# Altium schematic sheet MCU.SchDoc
size A; SheetNumber: 2; SheetTotal: 3
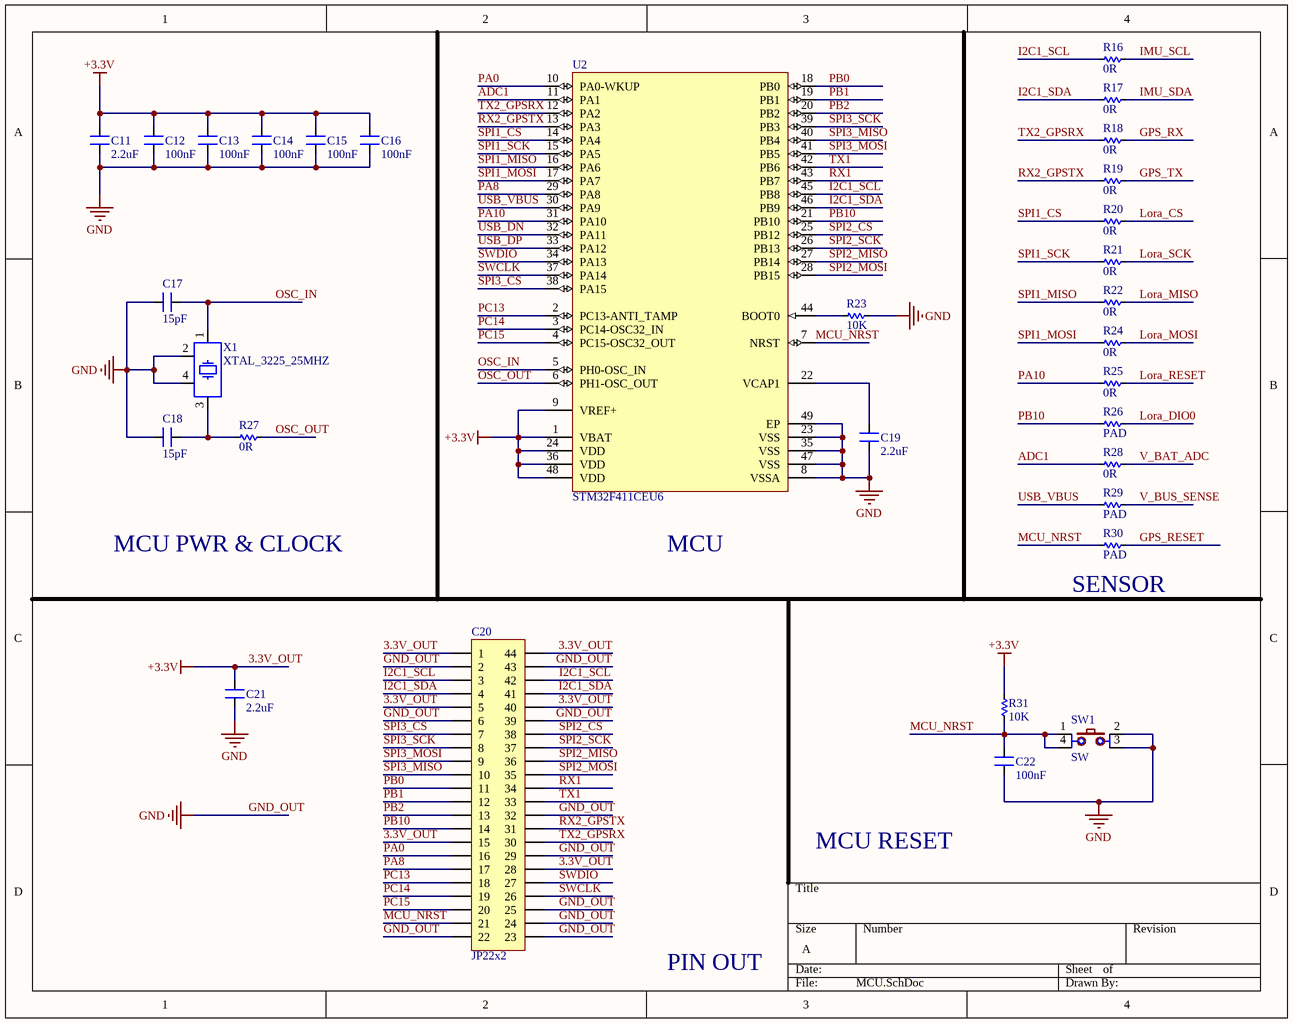
[diagram p0: MCU.SchDoc]

## Parts
C11  2.2uF  [CN-SMD-0805]
C12  100nF  [CN-SMD-0603]
C13  100nF  [CN-SMD-0603]
C14  100nF  [CN-SMD-0603]
C15  100nF  [CN-SMD-0603]
C16  100nF  [CN-SMD-0603]
C17  15pF  [CN-SMD-0603]
C18  15pF  [CN-SMD-0603]
C19  2.2uF  [CN-SMD-0805]
C20  JP22x2  [JP22-D2T]
C21  2.2uF  [CN-SMD-0805]
C22  100nF  [CN-SMD-0603]
R16  0R  [RES-SMD-0603]
R17  0R  [RES-SMD-0603]
R18  0R  [RES-SMD-0603]
R19  0R  [RES-SMD-0603]
R20  0R  [RES-SMD-0603]
R21  0R  [RES-SMD-0603]
R22  0R  [RES-SMD-0603]
R23  10K  [RES-SMD-0603]
R24  0R  [RES-SMD-0603]
R25  0R  [RES-SMD-0603]
R26  PAD  [PAD-RES-SMD-0603]
R27  0R  [RES-SMD-0603]
R28  0R  [RES-SMD-0603]
R29  PAD  [PAD-RES-SMD-0603]
R30  PAD  [PAD-RES-SMD-0603]
R31  10K  [RES-SMD-0603]
SW1  SW  [SW2-SMD]
U2  STM32F411CEU6  [STM-UFQFPN48_L]
X1  XTAL_3225_25MHZ  [XTAL_3225]

## Nets
3.3V_OUT: C11.2 C12.2 C13.2 C14.2 C15.2 C16.2 C20.1 C20.5 C20.15 C20.28 C20.40 C20.44 C21.2 R31.1 U2.1(VBAT) U2.9(VREF+) U2.24(VDD) U2.36(VDD) U2.48(VDD)  [also labelled +3.3V]
GND_OUT: C11.1 C12.1 C13.1 C14.1 C15.1 C16.1 C17.2 C18.2 C19.1 C20.2 C20.6 C20.22 C20.23 C20.24 C20.25 C20.29 C20.32 C20.39 C20.43 C21.1 C22.1 R23.2 SW1.2 SW1.3 U2.8(VSSA) U2.23(VSS) U2.35(VSS) U2.47(VSS) U2.49(EP) X1.2 X1.4  [also labelled GND]
ADC1: R28.1 U2.11(PA1)
GPS_RESET: R30.2
GPS_RX: R18.2
GPS_TX: R19.2
I2C1_SCL: C20.3 C20.42 R16.1 U2.45(PB8)
I2C1_SDA: C20.4 C20.41 R17.1 U2.46(PB9)
IMU_SCL: R16.2
IMU_SDA: R17.2
Lora_CS: R20.2
Lora_DIO0: R26.2
Lora_MISO: R22.2
Lora_MOSI: R24.2
Lora_RESET: R25.2
Lora_SCK: R21.2
MCU_NRST: C20.21 C22.2 R30.1 R31.2 SW1.1 SW1.4 U2.7(NRST)
OSC_IN: C17.1 U2.5(PH0-OSC_IN) X1.1
OSC_OUT: R27.2 U2.6(PH1-OSC_OUT)
PA0: C20.16 U2.10(PA0-WKUP)
PA8: C20.17 U2.29(PA8)
PA10: R25.1 U2.31(PA10)
PB0: C20.11 U2.18(PB0)
PB1: C20.12 U2.19(PB1)
PB2: C20.13 U2.20(PB2)
PB10: C20.14 R26.1 U2.21(PB10)
PC13: C20.18 U2.2(PC13-ANTI_TAMP)
PC14: C20.19 U2.3(PC14-OSC32_IN)
PC15: C20.20 U2.4(PC15-OSC32_OUT)
RX1: C20.34 U2.43(PB7)
RX2_GPSTX: C20.31 R19.1 U2.13(PA3)
SPI1_CS: R20.1 U2.14(PA4)
SPI1_MISO: R22.1 U2.16(PA6)
SPI1_MOSI: R24.1 U2.17(PA7)
SPI1_SCK: R21.1 U2.15(PA5)
SPI2_CS: C20.38 U2.25(PB12)
SPI2_MISO: C20.36 U2.27(PB14)
SPI2_MOSI: C20.35 U2.28(PB15)
SPI2_SCK: C20.37 U2.26(PB13)
SPI3_CS: C20.7 U2.38(PA15)
SPI3_MISO: C20.10 U2.40(PB4)
SPI3_MOSI: C20.9 U2.41(PB5)
SPI3_SCK: C20.8 U2.39(PB3)
SWCLK: C20.26 U2.37(PA14)
SWDIO: C20.27 U2.34(PA13)
TX1: C20.33 U2.42(PB6)
TX2_GPSRX: C20.30 R18.1 U2.12(PA2)
USB_DN: U2.32(PA11)
USB_DP: U2.33(PA12)
USB_VBUS: R29.1 U2.30(PA9)
V_BAT_ADC: R28.2
V_BUS_SENSE: R29.2
NetC18_1: C18.1 R27.1 X1.3
NetC19_2: C19.2 U2.22(VCAP1)
NetR23_1: R23.1 U2.44(BOOT0)

## Notes on the sheet
- MCU PWR & CLOCK
- MCU
- (near R30) SENSOR
- MCU RESET
- PIN OUT

## Library data of the parts
C11-C19 C21 C22 = Cap-SMD: Value: 33pF
C20 = JP22x2: WR-PHD 2.54 mm Dual Socket Header; Manufacturer: W¨¹rth Elektronik eiSos GmbH; partNo: 61304421821; ComponentLink1 Description: Manufacturer; ComponentLink2 Description: Datasheet; NoPins: 44; Created Date: 29 March 2013; ComponentLink1URL: http://www.we-online.com; ComponentLink2URL: http://katalog.we-online.de/em/datasheet/6130xx21821.pdf; Created by: Karrer Zheng
R16-R31 = Res-SMD: Resistor; Manufacturer: Generic Components; Class: Passive; Published: 08/06/2000; Publisher: Altium Hobart Technology Centre
SW1 = SW4: Switch button 4 pin; Value: Button chip 4 pin
U2 = STM32F411CEU6: ARM Cortex-M4 32-bit MCU+FPU, 512 KB Flash, 128 KB RAM, 36 I/Os, 48-Pin UFQFPN, -40 to 85 degC, Tray; Operating Frequency(F) (Processor speed) (MHz): 100; FLASH Size (Prog) (kB): 512; Internal RAM Size (kB): 128; I/Os (High Current): 36; Supply Voltage(Vcc) min (V): 1.7; Package Reference: 48-Pin Ultra Thin Fine Pitch Quad Flat No-Lead, 7 x 7 x 0.6 mm Body, 0.5 mm Pitch, Exposed Pad; ComponentLink1Description: Manufacturer URL; ComponentLink1URL: http://www.st.com/; Packing: Tray; Package Description: UFQFPN48; Core: ARM Cortex-M4; ComponentLink2Description: Datasheet; ComponentLink2URL: http://www.st.com/st-web-ui/static/active/en/resource/technical/document/datasheet/DM00115249.pdf; DatasheetVersion: Rev. 6; Mounting Technology: Surface Mount
X1 = XTAL 4 Pin: Crystal Oscillator; Distributor Link: *